# EAGLE design eagleExperiment2 (EAGLE 9.6.2)
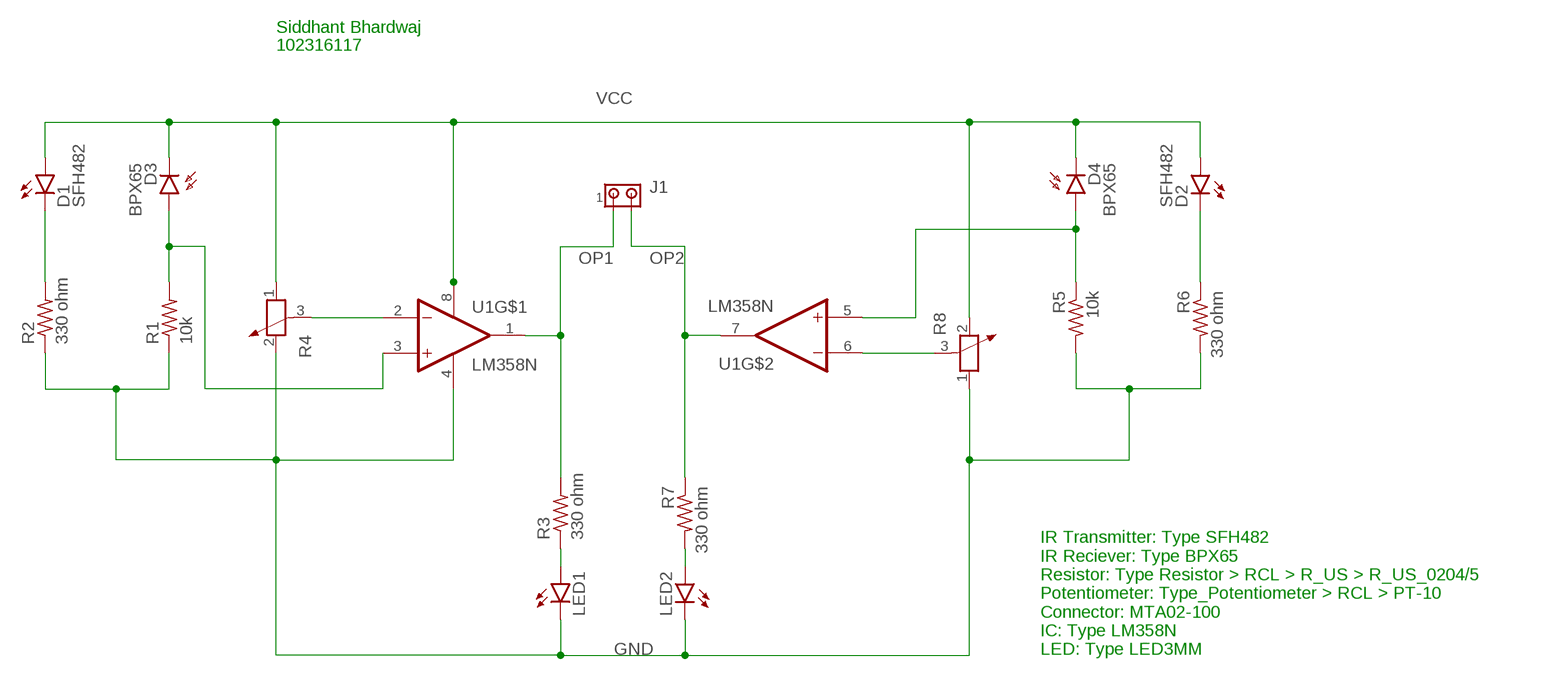
[diagram p0: schematic, sheet 1]

## Parts
D1  SFH482  [SFH482]
D2  SFH482  [SFH482]
D3  BPX65  [BPX65]
D4  BPX65  [BPX65]
J1  MTA02-100  [10X02MTA]
LED1  LED3MM  [LED3MM]
LED2  LED3MM  [LED3MM]
R1  10k  R-US_0204/5  [0204/5]
R2  330 ohm  R-US_0204/5  [0204/5]
R3  330 ohm  R-US_0204/5  [0204/5]
R4  POTENTIOMETER_PT-10  [PT-10]
R5  10k  R-US_0204/5  [0204/5]
R6  330 ohm  R-US_0204/5  [0204/5]
R7  330 ohm  R-US_0204/5  [0204/5]
R8  POTENTIOMETER_PT-10  [PT-10]
U1  LM358N  [DIP762W46P254L960H508Q8]

## Nets
GND: LED1.K(C) LED2.K(C) R1.1 R2.1 R4.2 R5.2 R6.2 R8.1 U1.4(GND)
N$2: LED1.A R3.1
N$5: D3.A R1.2 U1.3(1IN+)
N$6: R4.3 U1.2(1IN-)
N$7: D1.K(C) R2.2
N$9: LED2.A R7.2
N$10: R8.3 U1.6(2IN-)
N$11: D2.K(C) R6.1
N$12: D4.A R5.1 U1.5(2IN+)
OP1: J1.1 R3.2 U1.1(1OUT)
OP2: J1.2 R7.1 U1.7(2OUT)
VCC: D1.A D2.A D3.K(C) D4.K(C) R4.1 R8.2 U1.8(VCC)

## Notes on the sheet
- Siddhant Bhardwaj
- 102316117
- IR Transmitter: Type SFH482
  IR Reciever: Type BPX65
  Resistor: Type Resistor > RCL > R_US > R_US_0204/5
  Potentiometer: Type_Potentiometer > RCL > PT-10
  Connector: MTA02-100
  IC: Type LM358N
  LED: Type LED3MM

## Library data of the parts
D1 D2 = led:SFH482: IR LED infrared emitting diode, Infineon
D3 D4 = opto-trans-siemens:BPX65: PHOTO DIODE; MPN: BPX65.; OC_FARNELL: 327451; OC_NEWARK: 06WX2764
J1 = con-amp:MTA02-100: AMP connector
LED1 LED2 = led:LED: LED OSRAM: - CHIPLED LG R971, LG N971, LY N971, LG Q971, LY Q971, LO R971, LY R971 LH N974, LH R974 LS Q976, LO Q976, LY Q976 LO Q996 - Hyper CHIPLED LW Q18S LB Q993, LB Q99A, LB R99A - SideLED LS A670, LO A670, LY A670, LG A670, LP A670 LB A673, LV A673, LT A673, LW A673 LH A674 LY A675 LS A676, LA A676, LO A676, LY A676, LW A676 LS A679, LY A679, LG A679 - Hyper Micro SIDELED® LS Y876, LA Y876, LO Y876, LY Y876 LT Y87S - SmartLED LW L88C, LW L88S LB L89C, LB L89S, LG L890 LS L89K, LO L89K, LY L89K LS L896, LA L896, LO L896, LY L896 - TOPLED LS T670, LO T670, LY T670, LG T670, LP T670 LSG T670, LSP T670, LSY T670, LOP T670, LYG T670 LG T671, LOG T671, LSG T671 LB T673, LV T673, LT T673, LW T673 LH T674 LS T676, LA T676, LO T676, LY T676, LB T676, LH T676, LSB T676, LW T676 LB T67C, LV T67C, LT T67C, LS T67K, LO T67K, LY T67K, LW E67C LS E67B, LA E67B, LO E67B, LY E67B, LB E67C, LV E67C, LT E67C LW T67C LS T679, LY T679, LG T679 LS T770, LO T770, LY T770, LG T770, LP T770 LB T773, LV T773, LT T773, LW T773 LH T774 LS E675, LA E675, LY E675, LS T675 LS T776, LA T776, LO T776, LY T776, LB T776 LHGB T686 LT T68C, LB T68C - Hyper Mini TOPLED® LB M676 - Mini TOPLED Santana® LG M470 LS M47K, LO M47K, LY M47K Source: http://www.osram.convergy.de LUXEON: - LUMILED® LXK2-PW12-R00, LXK2-PW12-S00, LXK2-PW14-U00, LXK2-PW14-V00 LXK2-PM12-R00, LXK2-PM12-S00, LXK2-PM14-U00 LXK2-PE12-Q00, LXK2-PE12-R00, LXK2-PE12-S00, LXK2-PE14-T00, LXK2-PE14-U00 LXK2-PB12-K00, LXK2-PB12-L00, LXK2-PB12-M00, LXK2-PB14-N00, LXK2-PB14-P00, LXK2-PB14-Q00 LXK2-PR12-L00, LXK2-PR12-M00, LXK2-PR14-Q00, LXK2-PR14-R00 LXK2-PD12-Q00, LXK2-PD12-R00, LXK2-PD12-S00 LXK2-PH12-R00, LXK2-PH12-S00 LXK2-PL12-P00, LXK2-PL12-Q00, LXK2-PL12-R00 Source: www.luxeon.com KINGBRIGHT: KA-3528ASYC Source: www.kingbright.com
R1-R3 R5-R7 = rcl:R-US_: RESISTOR, American symbol; SPICEPREFIX: R
R4 R8 = rcl:POTENTIOMETER_: Potentiometer; SPICEMODEL: POT; SPICEPREFIX: X
U1 = LM358N:LM358N: IC OPAMP GP 2 CIRCUIT 8DIP Check availability <https://pricing.snapeda.com/parts/LM358N/Harris%20Corporation/view-part?ref=eda>; AVAILABILITY: Not in stock; CHECK_PRICES: https://www.snapeda.com/parts/LM358N/Harris/view-part/?ref=eda; DESCRIPTION: General Purpose Amplifier 2 Circuit 8-PDIP; MF: Harris Corporation; MP: LM358N; PACKAGE: None; PRICE: None; SNAPEDA_LINK: https://www.snapeda.com/parts/LM358N/Harris/view-part/?ref=snap

## Board
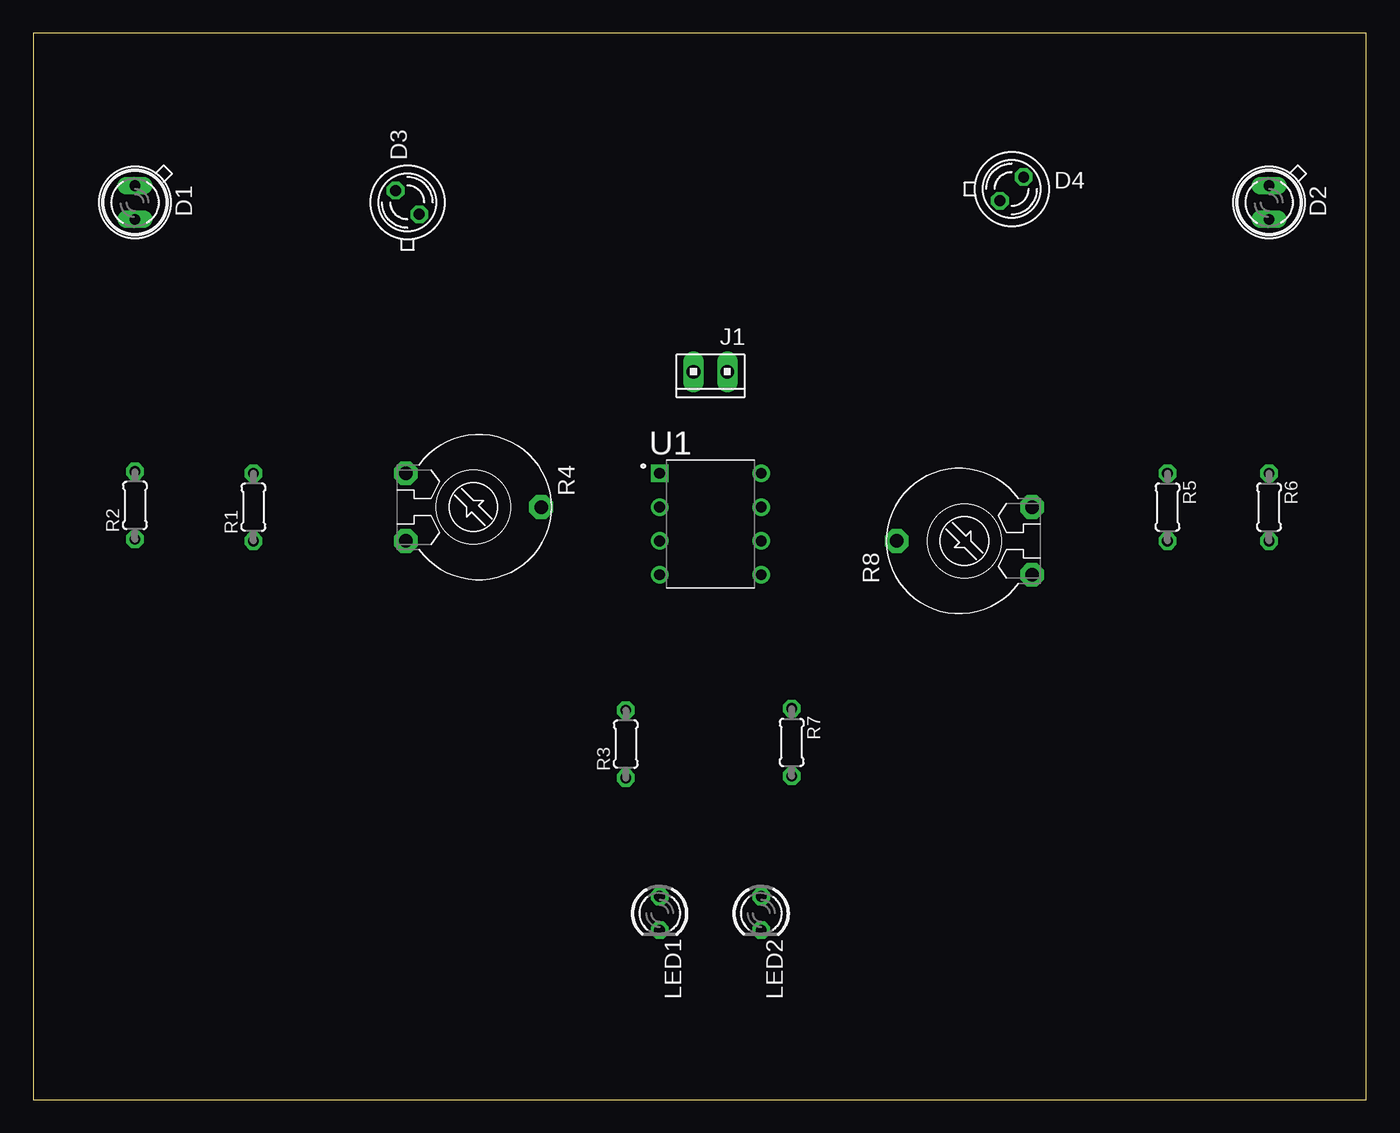
[diagram p1: board, top side]
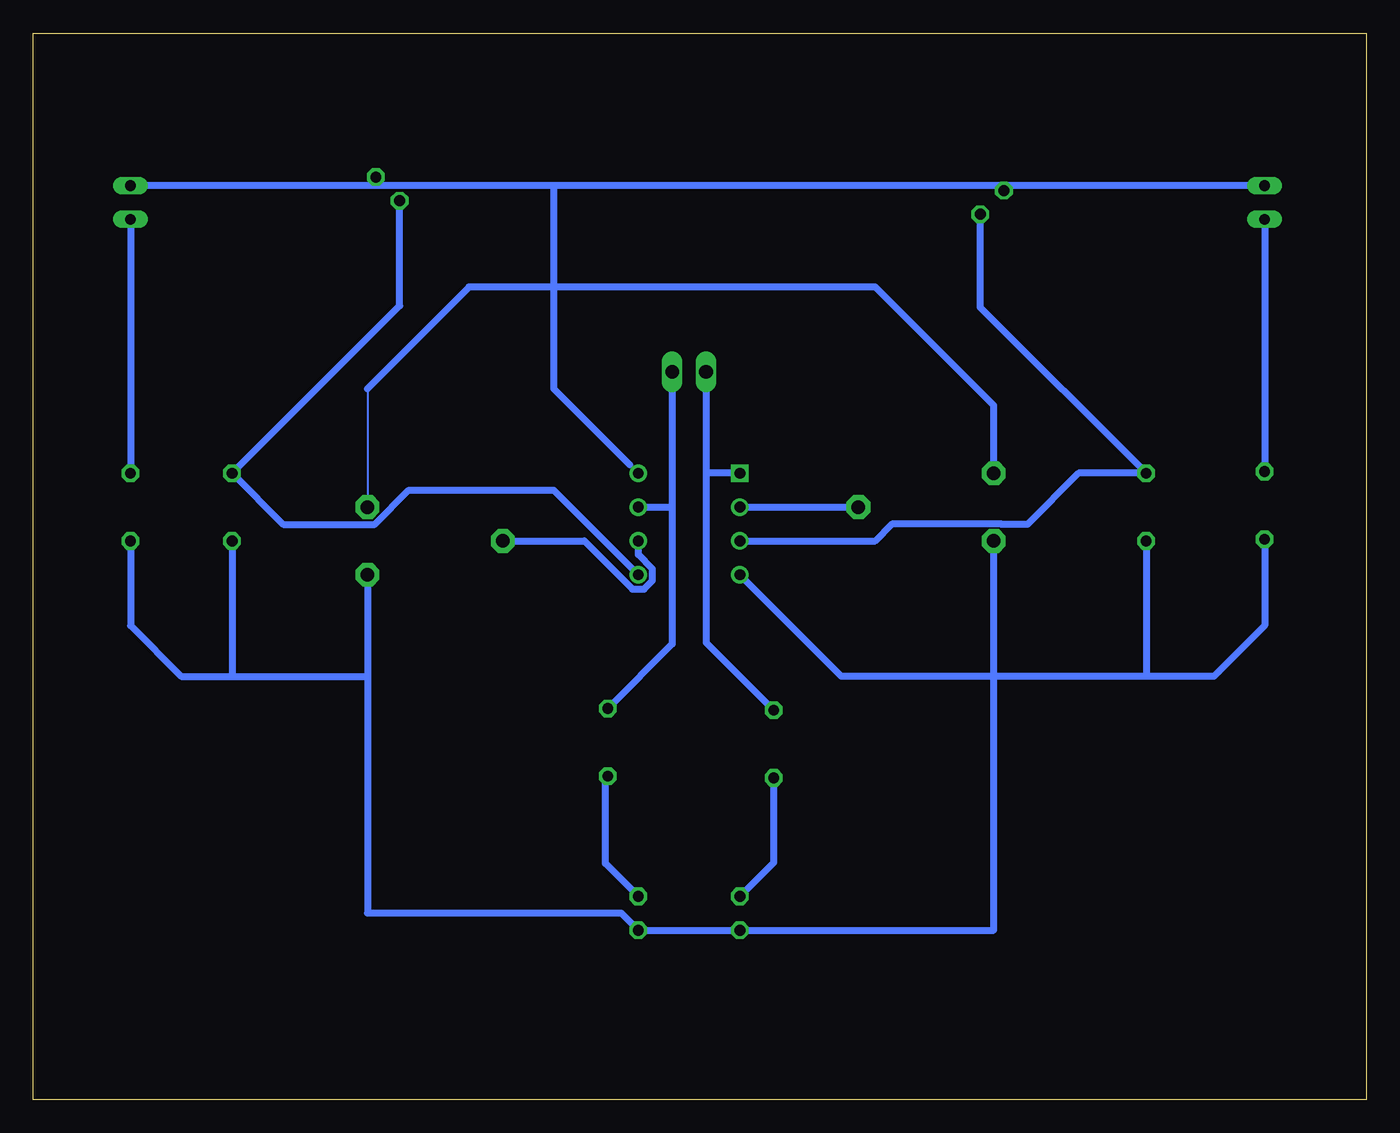
[diagram p2: board, bottom side, seen from below]

Size 100 x 80 mm. Coordinates in mm from the lower left corner, seen from the top.
Outline: 0,0 100,0 100,80 0,80 0,0
Copper layers (1*16): Top 0.035mm / dielectric 1.5mm / Bottom 0.035mm
Design rules "default": minimum track width 6mil, minimum drill 0.35mm, track to track 6mil, track to pad 6mil, pad to pad 6mil, via to via 6mil, smd to smd 6mil, copper to edge 40mil, drill to drill 6mil, minimum pad ring 10mil, minimum via ring 8mil, stop-mask expansion 4mil, vias tented up to drill 0mil, thermal gap 10mil

### Footprints (pad centres in the part's own frame; a part is rotated, then mirrored left to right if it is on the bottom)
SFH482 = drill 0.813 long: A -1.27,0; K 1.27,0
BPX65 = drill 0.813 octagon: A -0.889,-0.889; K 0.889,0.889
10X02MTA = drill 1.016 long: 1 1.27,0; 2 -1.27,0
LED3MM = drill 0.813 octagon: A -1.27,0; K 1.27,0
0204/5 = drill 0.813 octagon: 1 -2.54,0; 2 2.54,0
PT-10 = drill 1.016 pad 1.778 octagon: 1 -2.54,-5.08; 2 2.54,-5.08; 3 0,5.08
DIP762W46P254L960H508Q8 = drill 0.81 pad 1.22 square: 1 -3.81,3.81 | drill 0.81 pad 1.22: 2 -3.81,1.27; 3 -3.81,-1.27; 4 -3.81,-3.81; 5 3.81,-3.81; 6 3.81,-1.27; 7 3.81,1.27; 8 3.81,3.81

### Placement (x,y rotation side)
D1  7.62,67.31 270 top
D2  92.71,67.31 270 top
D3  28.07,67.31 90 top
D4  73.41,68.33 0 top
J1  50.8,54.61 180 top
LED1  46.99,13.97 270 top
LED2  54.61,13.97 270 top
R1  16.51,44.45 90 top
R2  7.62,44.58 90 top
R3  44.45,26.67 90 top
R4  33.02,44.45 270 top
R5  85.09,44.45 270 top
R6  92.71,44.45 270 top
R7  56.9,26.8 270 top
R8  69.85,41.91 90 top
U1  50.8,43.18 0 top

### Tracks (layer width: path | path; a pad name or v marks a point on that pad's centre or on a via)
GND
  Bottom 0.152: 39.37,31.75 27.94,31.75 | 27.94,31.75 16.51,31.75 | 27.94,12.7 27.94,31.75 | R4.2 27.94,31.75
  Bottom 0.508: R2.1 7.62,35.56 11.43,31.75 16.51,31.75 | 16.51,31.75 39.37,31.75 U1.4 | R1.1 16.51,31.75 | R4.2 27.94,12.7 LED1.K LED2.K 55.88,13.97 74.93,13.97 74.93,31.75 | R8.1 74.93,31.75 | R6.2 92.71,35.56 88.9,31.75 85.09,31.75 | 85.09,31.75 74.93,31.75 | R5.2 85.09,31.75
N$2
  Bottom 0.508: LED1.A 44.45,17.78 R3.1
N$5
  Bottom 0.152: 28.96,66.04 D3.A
  Bottom 0.508: 28.96,66.04 28.96,59.44 R1.2 21.59,46.99 25.4,43.18 27.38,43.18 27.4,43.2 35.53,43.2 36.83,41.91 U1.3
N$6
  Bottom 0.508: U1.2 R4.3
N$7
  Bottom 0.152: D1.K R2.2
  Bottom 0.508: D1.K 7.62,46.99
N$9
  Bottom 0.152: 57.09,24.07 R7.2
  Bottom 0.508: LED2.A 57.09,17.72 57.09,24.07
N$10
  Bottom 0.508: R8.3 58.66,41.91 55.05,38.3 54.17,38.3 53.55,38.93 53.55,39.81 54.61,40.88 U1.6
N$11
  Bottom 0.508: D2.K R6.1
N$12
  Bottom 0.508: D4.A 72.52,59.56 R5.1 81.25,43.16 74.39,43.16 71.83,45.72 60.96,45.72 U1.5
OP1
  Bottom 0.508: J1.1 49.53,46.99 | 49.53,46.99 49.53,34.29 R3.2 | U1.1 49.53,46.99
OP2
  Bottom 0.508: J1.2 52.07,44.45 | 52.07,44.45 52.07,34.29 52.07,34.16 R7.1 | U1.7 52.07,44.45
VCC
  Bottom 0.152: 60.96,60.96 60.96,68.58 | 67.31,60.96 60.96,60.96 | 60.96,60.96 36.83,60.96 | 74.93,53.34 R8.2 | U1.8 55.24,47.62 | 60.96,53.34 60.96,60.96 | D2.A 74.93,68.58 D4.K | D1.A 26.8,68.58 D3.K
  Bottom 0.508: D1.A 60.96,68.58 | 60.96,68.58 D2.A | 74.93,53.34 67.31,60.96 36.83,60.96 27.94,52.07 R4.1 | 60.96,68.58 60.96,53.34 55.24,47.62